# EasyEDA schematic new-schematic.json
TITLE: Sheet_1; REV: 1.0; Date: 2025-12-24; Sheet: 1/1; Drawn By: pkhrissanov; Company: Your Company
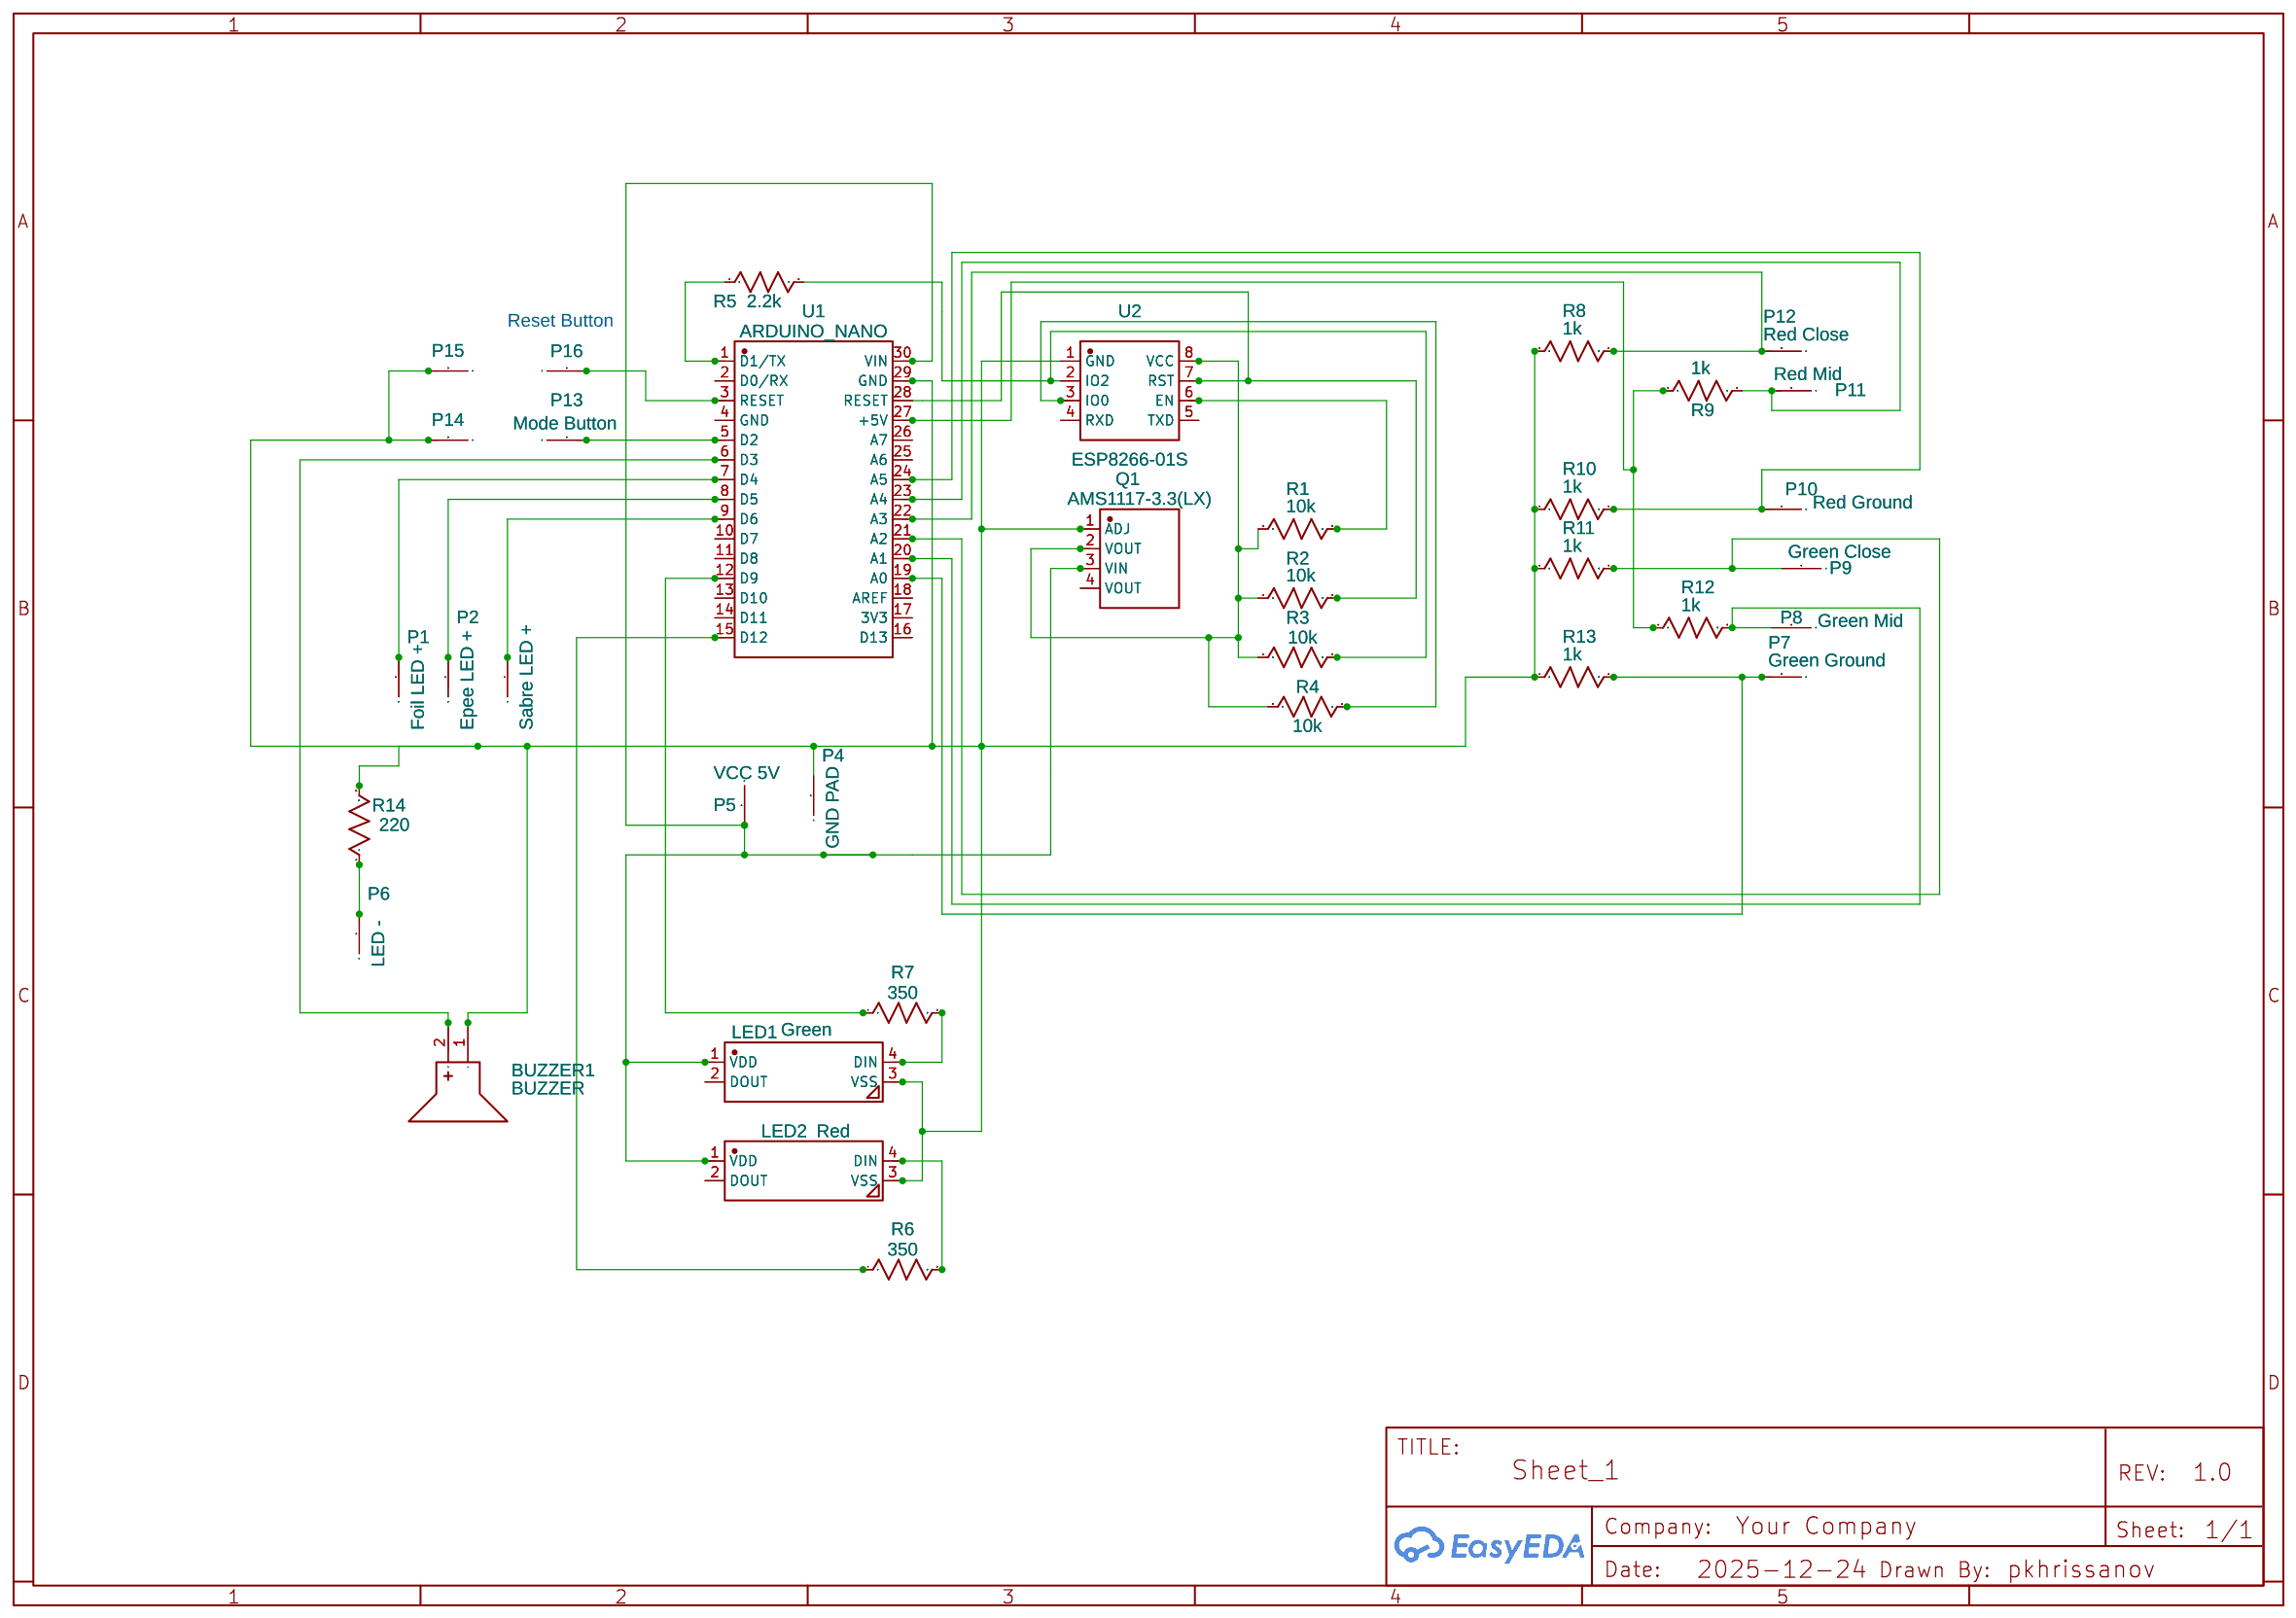
[diagram p0: schematic sheet]

## Parts
BUZZER1  BUZZER  [BUZ-TH_BD12.0-P6.00-D0.9-RD]
LED1  Green  [LED-SMD_4P-L5.0-W5.0-TL_WS2812B-B]
LED2  Red  [LED-SMD_4P-L5.0-W5.0-TL_WS2812B-B]
P1  Foil LED +  [WIRE_PAD_PTH_2X3.5]
P2  Epee LED +  [WIRE_PAD_PTH_2X3.5]
P3  Sabre LED +  [WIRE_PAD_PTH_2X3.5]
P4  GND PAD  [WIRE_PAD_PTH_2X3.5]
P5  VCC 5V  [WIRE_PAD_PTH_2X3.5]
P6  LED -  [WIRE_PAD_PTH_2X3.5]
P7  Green Ground  [WIRE_PAD_PTH_2X3.5]
P8  Green Mid  [WIRE_PAD_PTH_2X3.5]
P9  Green Close  [WIRE_PAD_PTH_2X3.5]
P10  Red Ground  [WIRE_PAD_PTH_2X3.5]
P11  Red Mid  [WIRE_PAD_PTH_2X3.5]
P12  Red Close  [WIRE_PAD_PTH_2X3.5]
P13  Mode Button  [WIRE_PAD_PTH_2X3.5]
P14  Foil LED +  [WIRE_PAD_PTH_2X3.5]
P15  Foil LED +  [WIRE_PAD_PTH_2X3.5]
P16  Foil LED +  [WIRE_PAD_PTH_2X3.5]
Q1  AMS1117-3.3(LX)  [SOT-223-3_L6.5-W3.4-P2.30-LS7.0-BR]
R1  10k  [R0603]
R2  10k  [R0603]
R3  10k  [R0603]
R4  10k  [R0603]
R5  2.2k  [R0603]
R6  350  [R0603]
R7  350  [R0603]
R8  1k  [R0603]
R9  1k  [R0603]
R10  1k  [R0603]
R11  1k  [R0603]
R12  1k  [R0603]
R13  1k  [R0603]
R14  220  [R0603]
U1  ARDUINO_NANO  [COMM-TH_ARDUINO_NANO]
U2  ESP8266-01S  [WIFIM-TH_ESP8266-01S]

## Library data of the parts
BUZZER1 = BUZZER: Contributor: lcsc; Supplier: LCSC; Supplier Part: C9900014030; Manufacturer: null; Manufacturer Part: buzzer; JLCPCB Part Class: Extended Part
LED1 LED2 = WS2812B-B/W: Contributor: LCSC; Supplier: LCSC; Supplier Part: C2761795; Manufacturer: worldsemi; Manufacturer Part: WS2812B-B/T; JLCPCB Part Class: Extended Part
P1-P16 = PAD: Contributor: albertleroux2012
Q1 = AMS1117-3.3(LX): Supplier: LCSC; Supplier Part: C24833654; Manufacturer: LX(灵星芯微); JLCPCB Part Class: Extended Part; Contributor: lcsc
R1-R14 = R_0603_US: Contributor: LCEDA_Lib
U1 = ARDUINO_NANO: Contributor: lcsc; Supplier: LCSC; Supplier Part: C9900017879; Manufacturer: null; JLCPCB Part Class: Extended Part
U2 = ESP8266-01S: Supplier: LCSC; Supplier Part: C9900150497; Manufacturer: null; JLCPCB Part Class: Extended Part; Contributor: lcsc

## Nets
Net-(BUZZER1-1): BUZZER1.1(-) LED1.3(VSS) LED2.3(VSS) P4.1 P14.1 P15.1 Q1.1(ADJ) R8.1 R10.1 R11.1 R13.1 R14.2 U1.29(GND) U2.1(GND)
Net-(BUZZER1-2): BUZZER1.2(+) U1.6(D3)
Net-(LED1-1): LED1.1(VDD) LED2.1(VDD) P5.1 Q1.3(VIN) U1.30(VIN)
Net-(LED1-4): LED1.4(DIN) R7.2
Net-(LED2-4): LED2.4(DIN) R6.2
Net-(P1-1): P1.1 U1.7(D4)
Net-(P2-1): P2.1 U1.8(D5)
Net-(P3-1): P3.1 U1.9(D6)
Net-(P6-1): P6.1 R14.1
Net-(P7-1): P7.1 R13.2 U1.19(A0)
Net-(P8-1): P8.1 R12.2 U1.20(A1)
Net-(P9-1): P9.1 R11.2 U1.21(A2)
Net-(P10-1): P10.1 R10.2 U1.24(A5)
Net-(P11-1): P11.1 R9.2 U1.23(A4)
Net-(P12-1): P12.1 R8.2 U1.22(A3)
Net-(P13-1): P13.1 U1.5(D2)
Net-(P16-1): P16.1 U1.3(RESET)
Net-(Q1-2): Q1.2(VOUT) R1.1 R2.1 R3.1 R4.1 U2.8(VCC)
Net-(R1-2): R1.2 U2.6(EN)
Net-(R2-2): R2.2 U1.28(RESET) U2.7(RST)
Net-(R3-2): R3.2 R5.2 U2.2(IO2)
Net-(R4-2): R4.2 U2.3(IO0)
Net-(R5-1): R5.1 U1.1(D1/TX)
Net-(R6-1): R6.1 U1.15(D12)
Net-(R7-1): R7.1 U1.12(D9)
Net-(R9-1): R9.1 R12.1 U1.27(+5V)

Not connected (* = marked no-connect by the designer): LED1 2(DOUT); LED2 2(DOUT); Q1 4(VOUT); U1 2(D0/RX) 4(GND) 10(D7) 11(D8) 13(D10) 14(D11) 16(D13) 17(3V3) 18(AREF) 25(A6) 26(A7); U2 4(RXD) 5(TXD)

## Notes on the sheet
- Reset Button
